# Altium schematic sheet Input.SchDoc
size A4
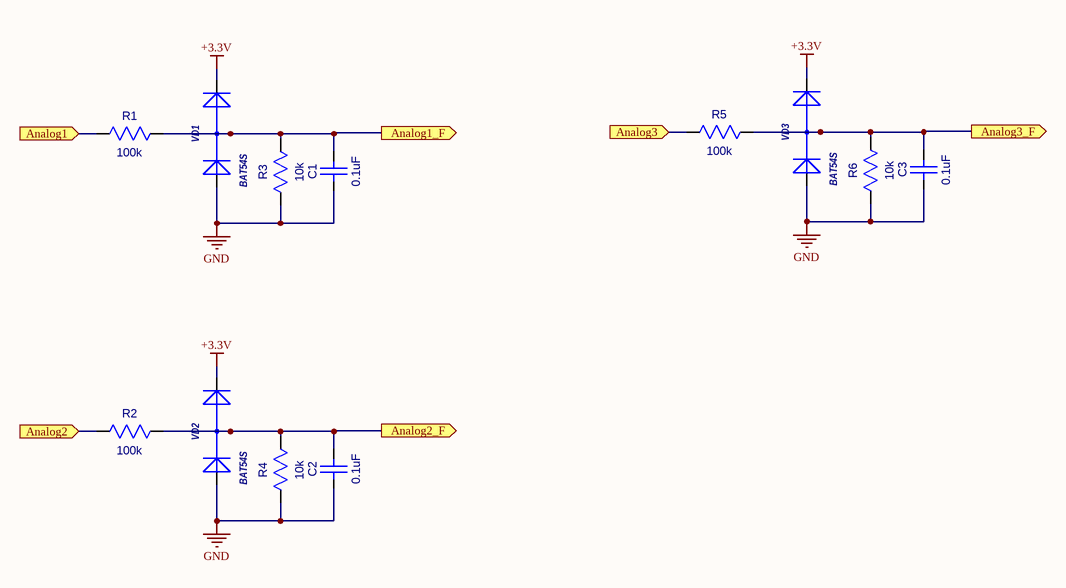
[diagram p0: Input.SchDoc]

## Parts
C1  0.1uF  [CC0603-3M]
C2  0.1uF  [CC0603-3M]
C3  0.1uF  [CC0603-3M]
R1  100k  [RC0603-3M]
R2  100k  [RC0603-3M]
R3  10k  [RC0603-3M]
R4  10k  [RC0603-3M]
R5  100k  [RC0603-3M]
R6  10k  [RC0603-3M]
VD1  BAT54S  [SOT-23(GSD)]
VD2  BAT54S  [SOT-23(GSD)]
VD3  BAT54S  [SOT-23(GSD)]

## Ports
Analog1 (in), Analog1_F (out), Analog2 (in), Analog2_F (out), Analog3 (in), Analog3_F (out)

## Nets
+3.3V: VD1.2(K) VD2.2(K) VD3.2(K)
GND: C1.1(A) C2.1(A) C3.1(A) R3.1(A) R4.1(A) R6.1(A) VD1.1(A) VD2.1(A) VD3.1(A)
Analog1: R1.1(A) ; port Analog1
Analog1_F: C1.2(B) R1.2(B) R3.2(B) VD1.3(AK) ; port Analog1_F
Analog2: R2.1(A) ; port Analog2
Analog2_F: C2.2(B) R2.2(B) R4.2(B) VD2.3(AK) ; port Analog2_F
Analog3: R5.1(A) ; port Analog3
Analog3_F: C3.2(B) R5.2(B) R6.2(B) VD3.3(AK) ; port Analog3_F

## Library data of the parts
C1-C3 = CC0603: Value: 0.1uF
R1-R6 = RC0603
  R1 R2 R5: Value: 100k
  R3 R4 R6: Value: 10k
VD1-VD3 = BAT54S: 1.0 Ampere General Purpose Rectifier; ComponentField6: Published 8-Jun-2000, Modified 11-July-2000: SIM Model Added.; Value: *